# Altium project bwaba.PrjPcb
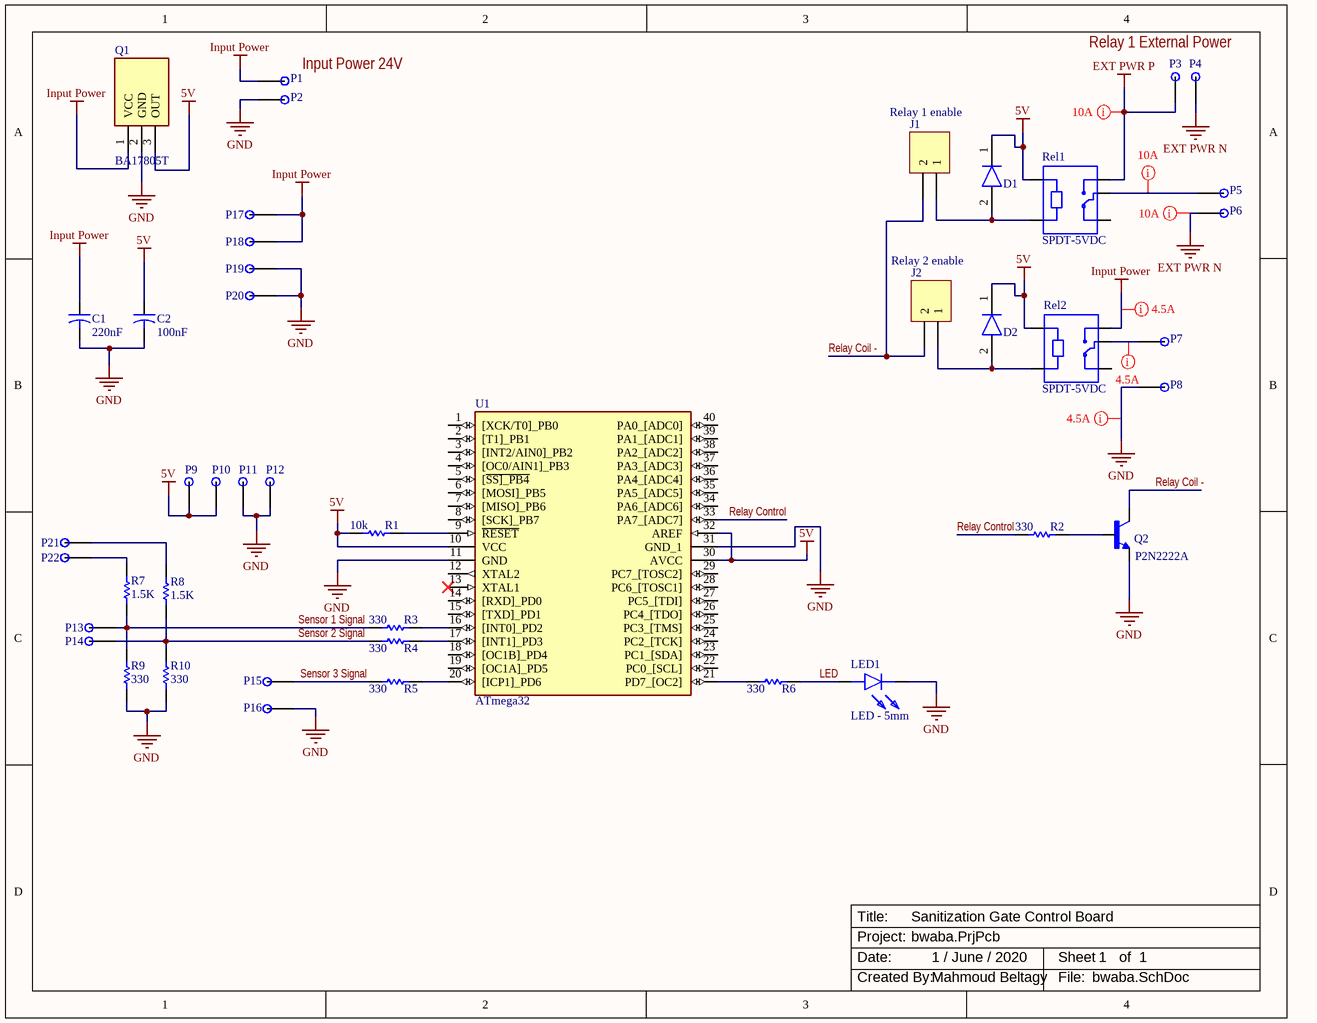
[diagram p0: bwaba.SchDoc]
1 sheet, 44 parts. Net scope: global (net labels, ports and power ports of the same name join across sheets).
Board file: bwaba.PcbDoc

## Sheet bwaba.SchDoc: Sanitization Gate Control Board
size A; Date: 1 / June / 2020; Author: Mahmoud Beltagy; SheetNumber: 1; SheetTotal: 1

### Parts
C1  220nF  [CAPR5-4X5]
C2  100nF  [CAPR5-4X5]
D1  1N4007  [Diode Generic]  (value not drawn)
D2  1N4007  [Diode Generic]  (value not drawn)
J1  Relay 1 enable  [HDR1X2]
J2  Relay 2 enable  [HDR1X2]
LED1  LED - 5mm  [LED - 5mm]
P1  TH Pad - 2mm  [TH Pad - 2mm]  (value not drawn)
P2  TH Pad - 2mm  [TH Pad - 2mm]  (value not drawn)
P3  TH Pad - 2mm  [TH Pad - 2mm]  (value not drawn)
P4  TH Pad - 2mm  [TH Pad - 2mm]  (value not drawn)
P5  TH Pad - 2mm  [TH Pad - 2mm]  (value not drawn)
P6  TH Pad - 2mm  [TH Pad - 2mm]  (value not drawn)
P7  TH Pad - 2mm  [TH Pad - 2mm]  (value not drawn)
P8  TH Pad - 2mm  [TH Pad - 2mm]  (value not drawn)
P9  TH Pad - 2mm  [TH Pad - 2mm]  (value not drawn)
P10  TH Pad - 2mm  [TH Pad - 2mm]  (value not drawn)
P11  TH Pad - 2mm  [TH Pad - 2mm]  (value not drawn)
P12  TH Pad - 2mm  [TH Pad - 2mm]  (value not drawn)
P13  TH Pad - 2mm  [TH Pad - 2mm]  (value not drawn)
P14  TH Pad - 2mm  [TH Pad - 2mm]  (value not drawn)
P15  TH Pad - 2mm  [TH Pad - 2mm]  (value not drawn)
P16  TH Pad - 2mm  [TH Pad - 2mm]  (value not drawn)
P17  TH Pad - 2mm  [TH Pad - 2mm]  (value not drawn)
P18  TH Pad - 2mm  [TH Pad - 2mm]  (value not drawn)
P19  TH Pad - 2mm  [TH Pad - 2mm]  (value not drawn)
P20  TH Pad - 2mm  [TH Pad - 2mm]  (value not drawn)
P21  TH Pad - 2mm  [TH Pad - 2mm]  (value not drawn)
P22  TH Pad - 2mm  [TH Pad - 2mm]  (value not drawn)
Q1  BA17805T  [TO254P480X1010X2280-3P]
Q2  P2N2222A  [TO92]
R1  10k  [AXIAL-0.3]
R2  330  [AXIAL-0.3]
R3  330  [AXIAL-0.3]
R4  330  [AXIAL-0.3]
R5  330  [AXIAL-0.3]
R6  330  [AXIAL-0.3]
R7  1.5K  [AXIAL-0.3]
R8  1.5K  [AXIAL-0.3]
R9  330  [AXIAL-0.3]
R10  330  [AXIAL-0.3]
Rel1  SPDT-5VDC  [SRD-5VDC]
Rel2  SPDT-5VDC  [SRD-5VDC]
U1  ATmega32  [DIP1556W56P254L5232H483Q40N]

### Nets
5V: C2.1 D1.1(K) D2.1(K) P9.1(P) P10.1(P) Q1.3(OUT) R1.1 Rel1.A1 Rel2.A1 U1.10(VCC) U1.30(AVCC) U1.32(AREF)
EXT PWR N: P4.1(P) P6.1(P)
EXT PWR P: P3.1(P) Rel1.NO
GND: C1.2 C2.2 LED1.2(K) P2.1(P) P8.1(P) P11.1(P) P12.1(P) P16.1(P) P19.1(P) P20.1(P) Q1.2(GND) Q2.1(E) R9.1 R10.1 U1.11(GND) U1.31(GND_1)
Input Power: C1.1 P1.1(P) P17.1(P) P18.1(P) Q1.1(VCC) Rel2.NO
LED: LED1.1(A) R6.2
Relay Coil -: J1.2 J2.2 Q2.3(C)
Relay Control: R2.1 U1.33(PA7_[ADC7])
Sensor 1 Signal: P13.1(P) R3.1 R7.1 R9.2
Sensor 2 Signal: P14.1(P) R4.1 R8.1 R10.2
Sensor 3 Signal: P15.1(P) R5.1
NetD1_2: D1.2(A) J1.1 Rel1.A2
NetD2_2: D2.2(A) J2.1 Rel2.A2
NetP5_1: P5.1(P) Rel1.COM
NetP7_1: P7.1(P) Rel2.COM
NetP21_1: P21.1(P) R8.2
NetP22_1: P22.1(P) R7.2
NetQ2_2: Q2.2(B) R2.2
NetR1_2: R1.2 U1.9(~{RESET})
NetR3_2: R3.2 U1.16([INT0]_PD2)
NetR4_2: R4.2 U1.17([INT1]_PD3)
NetR5_2: R5.2 U1.20([ICP1]_PD6)
NetR6_1: R6.1 U1.21(PD7_[OC2])

Not connected (* = marked no-connect by the designer): Rel1 NC; Rel2 NC; U1 1([XCK/T0]_PB0) 2([T1]_PB1) 3([INT2/AIN0]_PB2) 4([OC0/AIN1]_PB3) 5([~{SS]_PB4}) 6([MOSI]_PB5) 7([MISO]_PB6) 8([SCK]_PB7) 12(XTAL2) 13(XTAL1)* 14([RXD]_PD0) 15([TXD]_PD1) 18([OC1B]_PD4) 19([OC1A]_PD5) 22(PC0_[SCL]) 23(PC1_[SDA]) 24(PC2_[TCK]) 25(PC3_[TMS]) 26(PC4_[TDO]) 27(PC5_[TDI]) 28(PC6_[TOSC1]) 29(PC7_[TOSC2]) 34(PA6_[ADC6]) 35(PA5_[ADC5]) 36(PA4_[ADC4]) 37(PA3_[ADC3]) 38(PA2_[ADC2]) 39(PA1_[ADC1]) 40(PA0_[ADC0])

### Layout directives
rule Width Constraint [Pref Width = 145mil    Min Width = 145mil    Max Width = 150mil]: EXT PWR N, EXT PWR P, NetP5_1
rule Width Constraint [Pref Width = 50mil    Min Width = 10mil    Max Width = 55mil]: GND, Input Power, NetP7_1

### Notes on the sheet
- Input Power 24V
- Relay 1 External Power
- Title:
- Date:
- Created By:
- Project:
- Sheet
- File:
- of

### Library data of the parts
C1 C2 = Cap2: Capacitor; Published: 23-Sep-2002; PackageReference: CAPR5-4X5; Publisher: Altium Limited; PackageDescription: Capacitor; 2 Leads
  C1: Value: 220nF
  C2: Value: 100nF
D1 D2 = 1N4007: Diode; Manufacturer_Name: ON Semiconductor; Datasheet Link: http://www.onsemi.com/pub/Collateral/1N4001-D.PDF; Manufacturer_Part_Number: 1N4007; Arrow Part Number: 1N4007; Arrow Price/Stock: https://www.arrow.com/en/products/1n4007/on-semiconductor; Mouser Part Number: 512-1N4007; Mouser Price/Stock: https://www.mouser.co.uk/ProductDetail/ON-Semiconductor-Fairchild/1N4007?qs=ZbYWOjW8mGpDHeErRxax7Q%3D%3D
J1 J2 = Header 2: Header, 2-Pin; LatestRevisionDate: 17-Jul-2002; LatestRevisionNote: Re-released for DXP Platform.; Publisher: Altium Limited
LED1 = LED - 5mm: LED; Manufacturer_Name: Kingbright; Manufacturer_Part_Number: L-53GD; Datasheet Link: http://docs-emea.rs-online.com/webdocs/151e/0900766b8151e408.pdf; Arrow Part Number: L-53GD; Arrow Price/Stock: https://www.arrow.com/en/products/l-53gd/kingbright; Mouser Part Number: N/A; Mouser Price/Stock: https://www.mouser.co.uk/ProductDetail/Kingbright/L-53GD?qs=2JU0tDl2GZ2KA1NEp%252B9cyQ%3D%3D
Q1 = BA17805T: Voltage Regulator; Manufacturer_Name: ROHM Semiconductor; Datasheet Link: http://docs-emea.rs-online.com/webdocs/113a/0900766b8113ab9d.pdf; Height: 4.8mm; Manufacturer_Part_Number: BA17805T; Arrow Part Number: BA17805T; Mouser Part Number: 755-BA17805T; Mouser Price/Stock: https://www.mouser.co.uk/ProductDetail/ROHM-Semiconductor/BA17805T?qs=4kLU8WoGk0vqBpJIp83X0w%3D%3D
Q2 = P2N2222A: Transitor BJT_ NPN 40V 600mA 300 MHz 625mW TO-92-3; MF: ON Semiconductor; SnapEDA_Link: https://www.snapeda.com/parts/P2N2222A/ON%20Semiconductor/view-part/13920/?ref=snap; Availability: Unavailable; MP: P2N2222A; Price: None; Value: *; Package: TO-92 ON Semiconductor
R1-R6 R9 R10 = Res1: Resistor; Published: 8-Jun-2000; LatestRevisionDate: 17-Jul-2002; LatestRevisionNote: Re-released for DXP Platform.; PackageReference: AXIAL-0.3; Publisher: Altium Limited; PackageDescription: Axial Device, Thru-Hole; 2 Leads; 0.3 in Pin Spacing
  R1: Value: 10k
  R2-R6 R9 R10: Value: 330
R7 R8 = Res1: Resistor; Value: 330; Published: 8-Jun-2000; LatestRevisionDate: 17-Jul-2002; LatestRevisionNote: Re-released for DXP Platform.; PackageReference: AXIAL-0.3; Publisher: Altium Limited; PackageDescription: Axial Device, Thru-Hole; 2 Leads; 0.3 in Pin Spacing
Rel1 Rel2 = Relay-SRD-5VDC: Relay
U1 = ATMEGA32-16PU_1: AVR ATmega Microcontroller IC 8-Bit 16MHz 32KB _16K x 16_ FLASH 40-PDIP; Manufacturer_Name: Microchip; Datasheet Link: https://componentsearchengine.com//ATMEGA32-16PU.pdf; Height: 4.826mm; Mouser2 Part Number: 556-ATMEGA32-16PU; Mouser2 Price/Stock: https://www.mouser.com/Search/Refine.aspx?Keyword=556-ATMEGA32-16PU; Manufacturer_Part_Number: ATMEGA32-16PU